# EAGLE design protoboard (EAGLE 5.11)
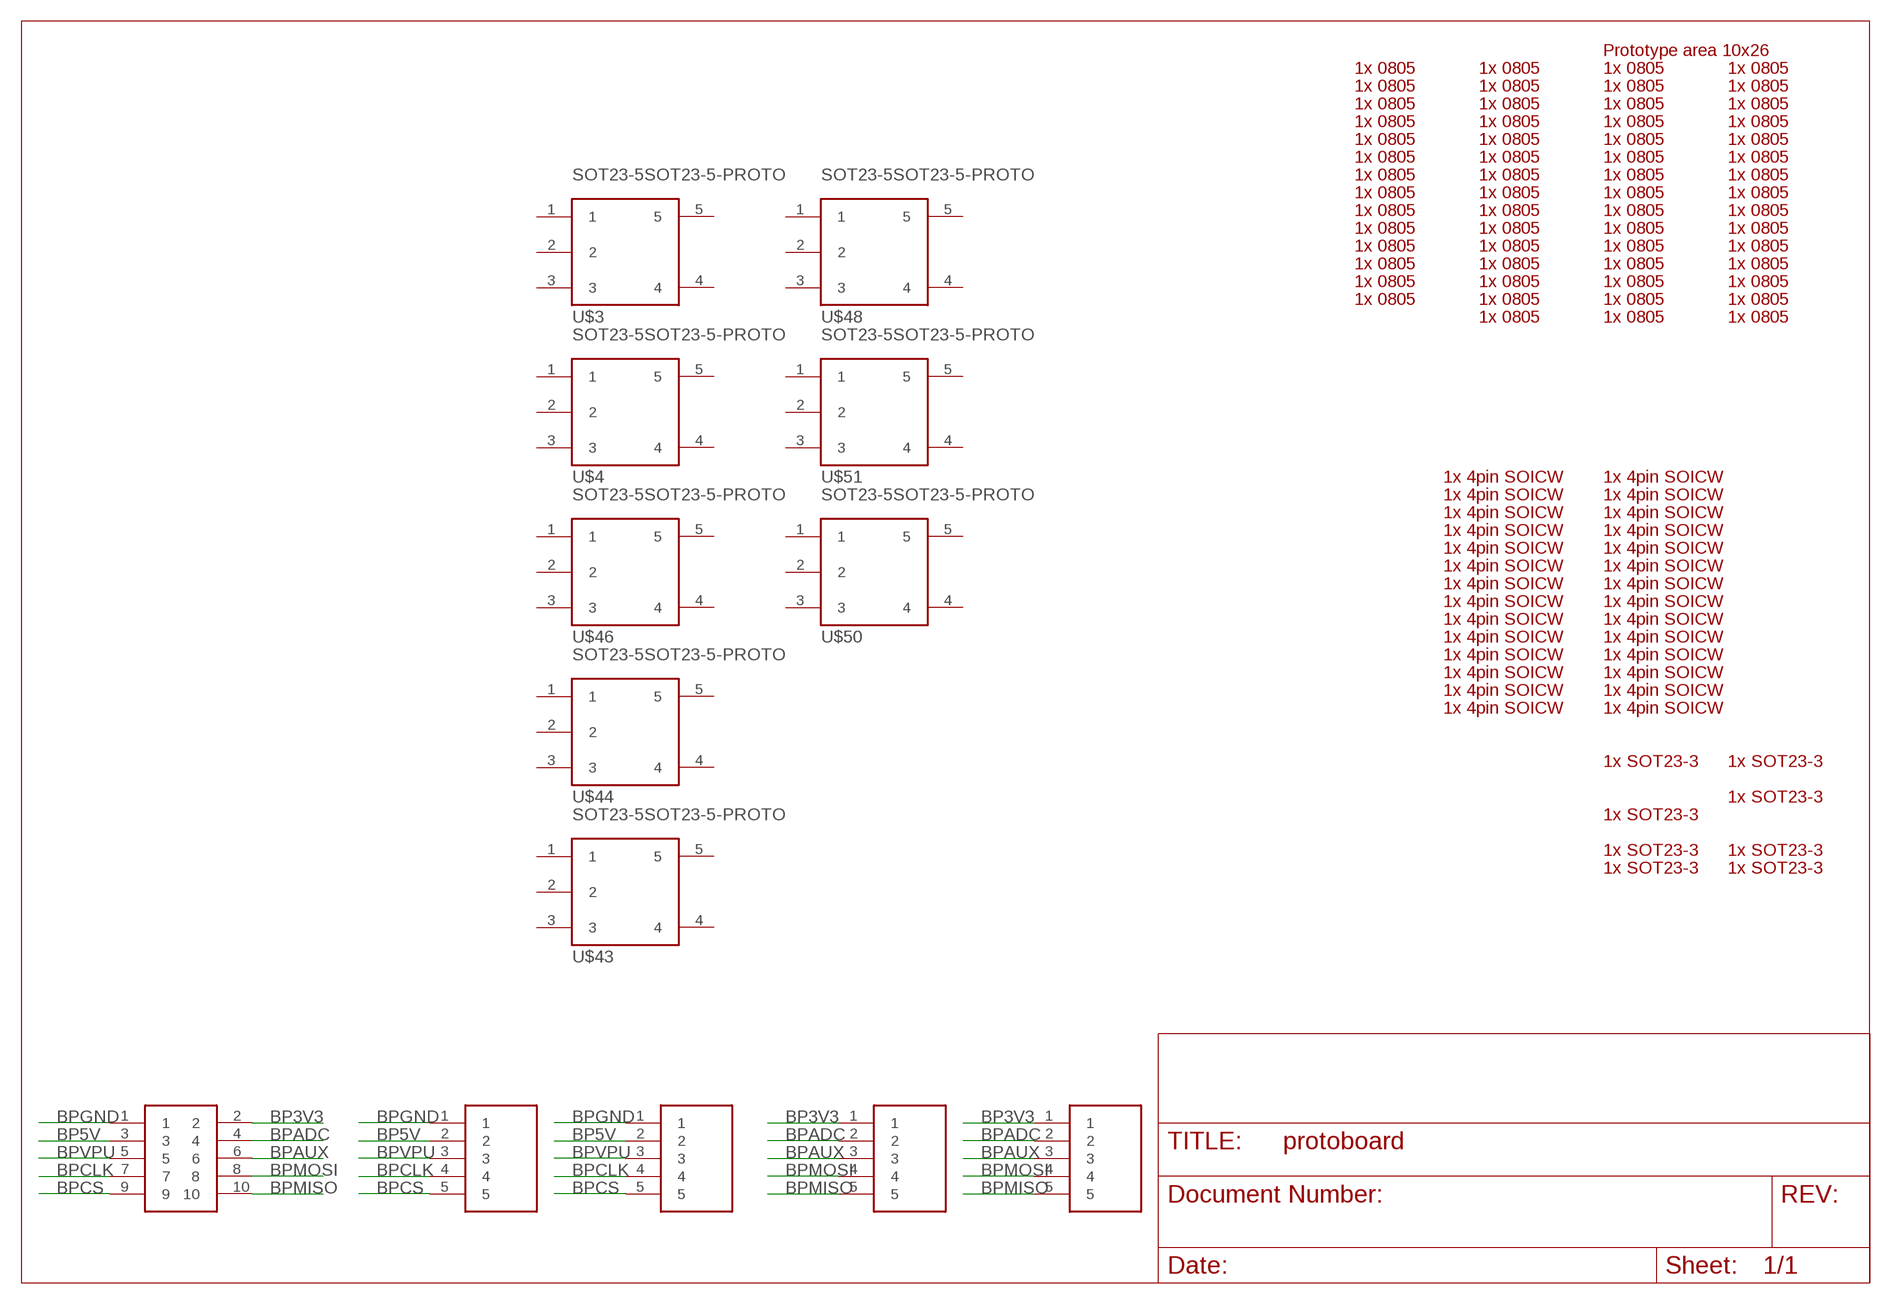
[diagram p0: schematic, sheet 1]

## Parts
J2  HEADER2X5PTH  [M2X5]
J3  HEADER1X5PTH  [M1X5]
J4  HEADER1X5PTH  [M1X5]
J5  HEADER1X5PTH  [M1X5]
J6  HEADER1X5PTH  [M1X5]
U$2  BB_SOT23-3  [BB_SOT23-3]
U$3  SOT23-5SOT23-5-PROTO  [SOT23-5-PROTO]
U$4  SOT23-5SOT23-5-PROTO  [SOT23-5-PROTO]
U$5  BB_SOT23-3  [BB_SOT23-3]
U$6  BB_SOICW  [BB_SOIC]
U$7  PROTO_10_26  [PROTO_10_26]
U$8  BB_RC0805  [BB_RC0805]
U$9  BB_RC0805  [BB_RC0805]
U$10  BB_RC0805  [BB_RC0805]
U$11  BB_RC0805  [BB_RC0805]
U$12  BB_RC0805  [BB_RC0805]
U$13  BB_RC0805  [BB_RC0805]
U$14  BB_RC0805  [BB_RC0805]
U$15  BB_RC0805  [BB_RC0805]
U$16  BB_RC0805  [BB_RC0805]
U$17  BB_RC0805  [BB_RC0805]
U$18  BB_RC0805  [BB_RC0805]
U$19  BB_RC0805  [BB_RC0805]
U$20  BB_RC0805  [BB_RC0805]
U$21  BB_RC0805  [BB_RC0805]
U$22  BB_RC0805  [BB_RC0805]
U$23  BB_RC0805  [BB_RC0805]
U$24  BB_RC0805  [BB_RC0805]
U$25  BB_RC0805  [BB_RC0805]
U$26  BB_RC0805  [BB_RC0805]
U$27  BB_RC0805  [BB_RC0805]
U$28  BB_RC0805  [BB_RC0805]
U$29  BB_RC0805  [BB_RC0805]
U$30  BB_RC0805  [BB_RC0805]
U$31  BB_RC0805  [BB_RC0805]
U$32  BB_RC0805  [BB_RC0805]
U$33  BB_RC0805  [BB_RC0805]
U$34  BB_SOICW  [BB_SOIC]
U$35  BB_SOICW  [BB_SOIC]
U$36  BB_SOICW  [BB_SOIC]
U$37  BB_SOICW  [BB_SOIC]
U$38  BB_SOICW  [BB_SOIC]
U$39  BB_SOICW  [BB_SOIC]
U$40  BB_SOICW  [BB_SOIC]
U$41  BB_SOICW  [BB_SOIC]
U$42  BB_SOT23-3  [BB_SOT23-3]
U$43  SOT23-5SOT23-5-PROTO  [SOT23-5-PROTO]
U$44  SOT23-5SOT23-5-PROTO  [SOT23-5-PROTO]
U$45  BB_SOT23-3  [BB_SOT23-3]
U$46  SOT23-5SOT23-5-PROTO  [SOT23-5-PROTO]
U$47  BB_SOT23-3  [BB_SOT23-3]
U$48  SOT23-5SOT23-5-PROTO  [SOT23-5-PROTO]
U$49  BB_SOT23-3  [BB_SOT23-3]
U$50  SOT23-5SOT23-5-PROTO  [SOT23-5-PROTO]
U$51  SOT23-5SOT23-5-PROTO  [SOT23-5-PROTO]
U$52  BB_RC0805  [BB_RC0805]
U$53  BB_RC0805  [BB_RC0805]
U$54  BB_RC0805  [BB_RC0805]
U$55  BB_RC0805  [BB_RC0805]
U$56  BB_RC0805  [BB_RC0805]
U$57  BB_RC0805  [BB_RC0805]
U$58  BB_SOICW  [BB_SOIC]
U$59  BB_SOICW  [BB_SOIC]
U$60  BB_SOICW  [BB_SOIC]
U$61  BB_SOICW  [BB_SOIC]
U$62  BB_SOICW  [BB_SOIC]
U$63  BB_SOICW  [BB_SOIC]
U$64  BB_SOICW  [BB_SOIC]
U$65  BB_SOICW  [BB_SOIC]
U$66  BB_SOT23-3  [BB_SOT23-3]
U$67  BB_SOT23-3  [BB_SOT23-3]
U$68  BB_RC0805  [BB_RC0805]
U$69  BB_RC0805  [BB_RC0805]
U$70  BB_RC0805  [BB_RC0805]
U$71  BB_RC0805  [BB_RC0805]
U$72  BB_RC0805  [BB_RC0805]
U$73  BB_RC0805  [BB_RC0805]
U$74  BB_RC0805  [BB_RC0805]
U$75  BB_RC0805  [BB_RC0805]
U$76  BB_RC0805  [BB_RC0805]
U$77  BB_RC0805  [BB_RC0805]
U$78  BB_RC0805  [BB_RC0805]
U$79  BB_RC0805  [BB_RC0805]
U$80  BB_RC0805  [BB_RC0805]
U$81  BB_RC0805  [BB_RC0805]
U$82  BB_RC0805  [BB_RC0805]
U$83  BB_RC0805  [BB_RC0805]
U$84  BB_RC0805  [BB_RC0805]
U$85  BB_RC0805  [BB_RC0805]
U$86  BB_RC0805  [BB_RC0805]
U$87  BB_RC0805  [BB_RC0805]
U$88  BB_RC0805  [BB_RC0805]
U$89  BB_RC0805  [BB_RC0805]
U$90  BB_RC0805  [BB_RC0805]
U$91  BB_SOICW  [BB_SOIC]
U$92  BB_RC0805  [BB_RC0805]
U$93  BB_RC0805  [BB_RC0805]
U$94  BB_SOICW  [BB_SOIC]
U$95  BB_RC0805  [BB_RC0805]
U$96  BB_RC0805  [BB_RC0805]
U$97  BB_SOICW  [BB_SOIC]
U$98  BB_SOICW  [BB_SOIC]
U$99  BB_SOICW  [BB_SOIC]
U$100  BB_SOICW  [BB_SOIC]
U$101  BB_SOICW  [BB_SOIC]
U$102  BB_SOICW  [BB_SOIC]
U$103  BB_SOICW  [BB_SOIC]
U$104  BB_SOICW  [BB_SOIC]
U$105  BB_SOICW  [BB_SOIC]

## Nets
BP3V3: J2.2 J5.1 J6.1
BP5V: J2.3 J3.2 J4.2
BPADC: J2.4 J5.2 J6.2
BPAUX: J2.6 J5.3 J6.3
BPCLK: J2.7 J3.4 J4.4
BPCS: J2.9 J3.5 J4.5
BPGND: J2.1 J3.1 J4.1
BPMISO: J2.10 J5.5 J6.5
BPMOSI: J2.8 J5.4 J6.4
BPVPU: J2.5 J3.3 J4.3
Unconnected: U$3.1 U$3.2 U$3.3 U$3.4 U$3.5 U$4.1 U$4.2 U$4.3 U$4.4 U$4.5 U$43.1 U$43.2 U$43.3 U$43.4 U$43.5 U$44.1 U$44.2 U$44.3 U$44.4 U$44.5 U$46.1 U$46.2 U$46.3 U$46.4 U$46.5 U$48.1 U$48.2 U$48.3 U$48.4 U$48.5 U$50.1 U$50.2 U$50.3 U$50.4 U$50.5 U$51.1 U$51.2 U$51.3 U$51.4 U$51.5

## Library data of the parts
J2 = dp_devices:HEADER2X5
J3-J6 = dp_devices:HEADER1X5
U$2 U$5 U$42 U$45 U$47 U$49 U$66 U$67 = dp_devices:BB_SOT23-3
U$3 U$4 U$43 U$44 U$46 U$48 U$50 U$51 = ajray:SOT23-5
U$6 U$34-U$41 U$58-U$65 U$91 U$94 U$97-U$105 = dp_devices:BB_SOICW
U$7 = dp_devices:PROTO_10_26
U$8-U$33 U$52-U$57 U$68-U$90 U$92 U$93 U$95 U$96 = dp_devices:BB_RC0805

## Board
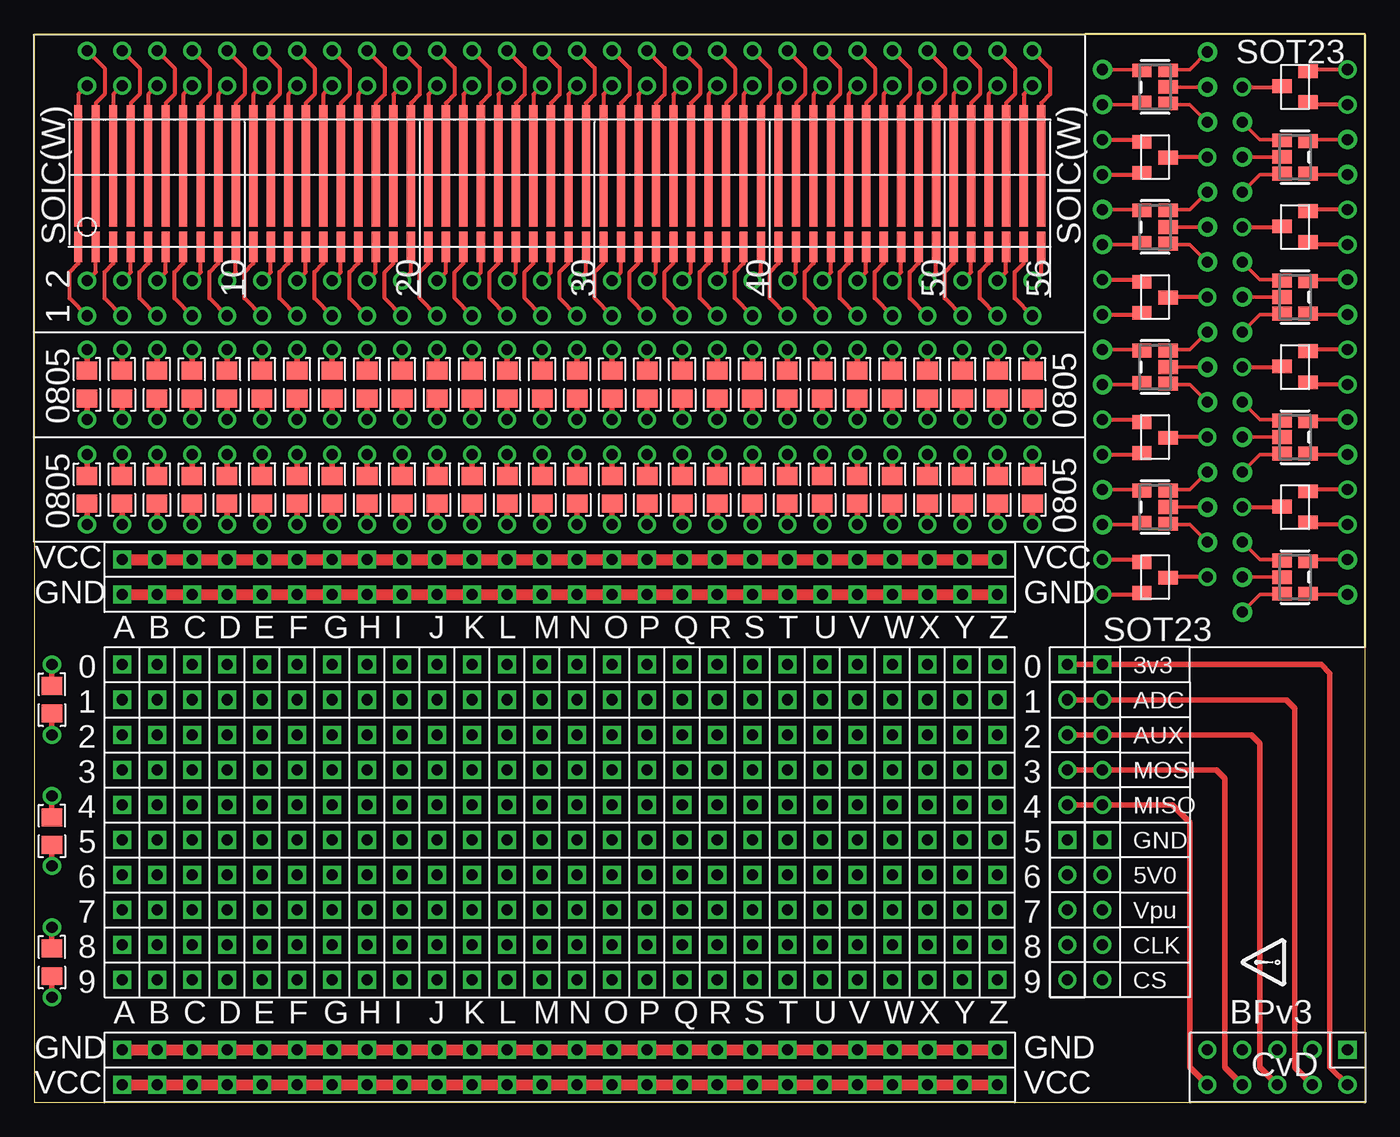
[diagram p1: board, top side]
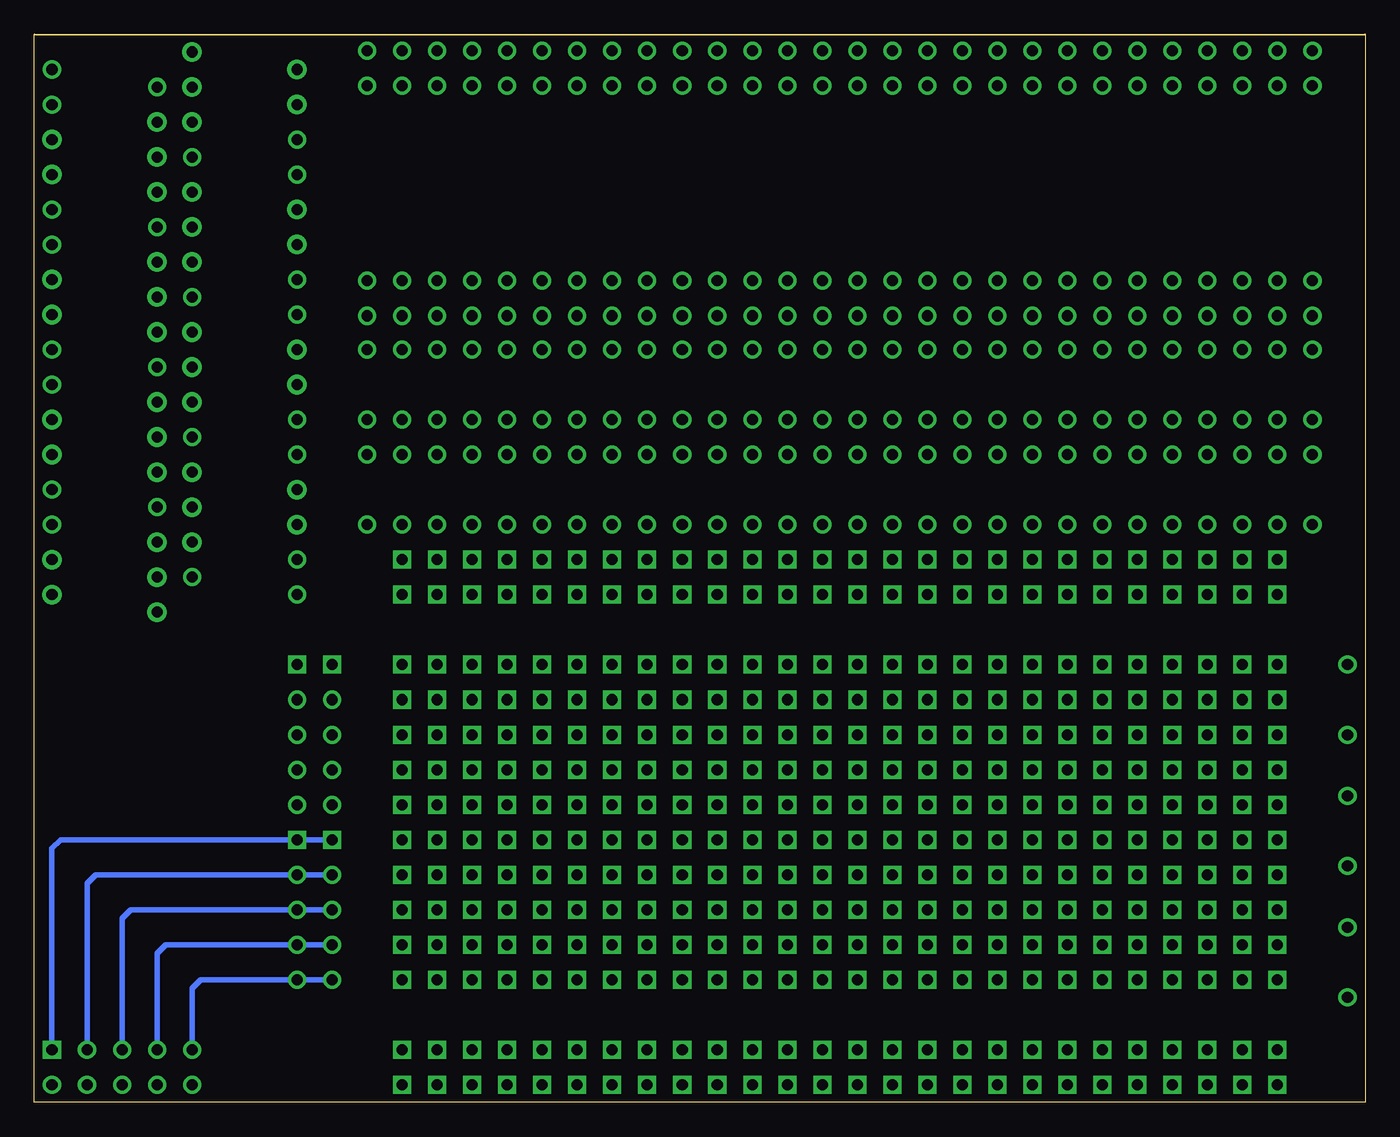
[diagram p2: board, bottom side, seen from below]

Size 96.52 x 77.47 mm. Coordinates in mm from the lower left corner, seen from the top.
Outline: 0,0 96.52,0 96.52,77.47 0,77.46 0,0
Copper layers (1*16): Top 0.035mm / dielectric 1.5mm / Bottom 0.035mm
Design rules "Fusion_eagle_rule_v1.1": minimum track width 6mil, minimum drill 12mil, track to track 6mil, track to pad 6mil, pad to pad 6mil, via to via 6mil, smd to smd 0mil, copper to edge 10mil, drill to drill 10mil, minimum pad ring 10mil, minimum via ring 6mil, stop-mask expansion 2mil, vias tented up to drill 100mil, thermal gap 10mil

### Footprints (pad centres in the part's own frame; a part is rotated, then mirrored left to right if it is on the bottom)
M2X5 = drill 0.8 square: 1 -5.08,-1.27 | drill 0.8 round: 2 -5.08,1.27; 3 -2.54,-1.27; 4 -2.54,1.27; 5 0,-1.27; 6 0,1.27; 7 2.54,-1.27; 8 2.54,1.27; 9 5.08,-1.27; 10 5.08,1.27
M1X5 = drill 0.8 square: 1 -5.08,0 | drill 0.8 round: 2 -2.54,0; 3 0,0; 4 2.54,0; 5 5.08,0
BB_SOT23-3 = smd 1.4 x 1: P$1 -0.95,1.1; P$2 -0.95,-1.15; P$3 0.95,-0.05 | drill 0.8 round: P$4 -3.81,-1.27; P$5 -3.81,1.27; P$6 3.81,0
SOT23-5-PROTO = smd 1.4 x 1: 1 -0.95,1.2; 2 -0.95,0; 3 -0.95,-1.2; 4 0.95,-1.2; 5 0.95,1.15 | drill 0.8 pad 1.422 round: P$1 -3.81,0; P$2 -3.81,-2.54; P$3 -3.81,2.54; P$4 3.81,-1.27; P$5 3.81,1.27
BB_SOIC = smd 2.2 x 0.6: P$1 -4.61,0.635; P$2 -4.61,-0.635 | smd 8.8 x 0.6: P$3 1.27,-0.635; P$4 1.27,0.635 | drill 0.8 round: P$5 -7.08,0; P$6 -9.62,0; P$7 7.08,0; P$8 9.62,0
PROTO_10_26 = drill 0.8 square: 1 -31.75,-11.43; 2 -29.21,-11.43; 3 -26.67,-11.43; 4 -24.13,-11.43; 5 -21.59,-11.43; 6 -19.05,-11.43; 7 -16.51,-11.43; 8 -13.97,-11.43; 9 -11.43,-11.43; 10 -8.89,-11.43; 11 -6.35,-11.43; 12 -3.81,-11.43; 13 -1.27,-11.43; 14 1.27,-11.43; 15 3.81,-11.43; 16 6.35,-11.43; 17 8.89,-11.43; 18 11.43,-11.43; 19 13.97,-11.43; 20 16.51,-11.43; 21 19.05,-11.43; 22 21.59,-11.43; 23 24.13,-11.43; 24 26.67,-11.43; 25 29.21,-11.43; 26 31.75,-11.43; 27 -31.75,-8.89; 28 -29.21,-8.89; 29 -26.67,-8.89; 30 -24.13,-8.89; 31 -21.59,-8.89; 32 -19.05,-8.89; 33 -16.51,-8.89; 34 -13.97,-8.89; 35 -11.43,-8.89; 36 -8.89,-8.89; 37 -6.35,-8.89; 38 -3.81,-8.89; 39 -1.27,-8.89; 40 1.27,-8.89; 41 3.81,-8.89; 42 6.35,-8.89; 43 8.89,-8.89; 44 11.43,-8.89; 45 13.97,-8.89; 46 16.51,-8.89; 47 19.05,-8.89; 48 21.59,-8.89; 49 24.13,-8.89; 50 26.67,-8.89; 51 29.21,-8.89; 52 31.75,-8.89; 53 -31.75,-6.35; 54 -29.21,-6.35; 55 -26.67,-6.35; 56 -24.13,-6.35; 57 -21.59,-6.35; 58 -19.05,-6.35; 59 -16.51,-6.35; 60 -13.97,-6.35; 61 -11.43,-6.35; 62 -8.89,-6.35; 63 -6.35,-6.35; 64 -3.81,-6.35; 65 -1.27,-6.35; 66 1.27,-6.35; 67 3.81,-6.35; 68 6.35,-6.35; 69 8.89,-6.35; 70 11.43,-6.35; 71 13.97,-6.35; 72 16.51,-6.35; 73 19.05,-6.35; 74 21.59,-6.35; 75 24.13,-6.35; 76 26.67,-6.35; 77 29.21,-6.35; 78 31.75,-6.35; 79 -31.75,-3.81; 80 -29.21,-3.81; 81 -26.67,-3.81; 82 -24.13,-3.81; 83 -21.59,-3.81; 84 -19.05,-3.81; 85 -16.51,-3.81; 86 -13.97,-3.81; 87 -11.43,-3.81; 88 -8.89,-3.81; 89 -6.35,-3.81; 90 -3.81,-3.81; 91 -1.27,-3.81; 92 1.27,-3.81; 93 3.81,-3.81; 94 6.35,-3.81; 95 8.89,-3.81; 96 11.43,-3.81; 97 13.97,-3.81; 98 16.51,-3.81; 99 19.05,-3.81; 100 21.59,-3.81; 101 24.13,-3.81; 102 26.67,-3.81; 103 29.21,-3.81; 104 31.75,-3.81; 105 -31.75,-1.27; 106 -29.21,-1.27; 107 -26.67,-1.27; 108 -24.13,-1.27; 109 -21.59,-1.27; 110 -19.05,-1.27; 111 -16.51,-1.27; 112 -13.97,-1.27; 113 -11.43,-1.27; 114 -8.89,-1.27; 115 -6.35,-1.27; 116 -3.81,-1.27; 117 -1.27,-1.27; 118 1.27,-1.27; 119 3.81,-1.27; 120 6.35,-1.27; 121 8.89,-1.27; 122 11.43,-1.27; 123 13.97,-1.27; 124 16.51,-1.27; 125 19.05,-1.27; 126 21.59,-1.27; 127 24.13,-1.27; 128 26.67,-1.27; 129 29.21,-1.27; 130 31.75,-1.27; 131 -31.75,1.27; 132 -29.21,1.27; 133 -26.67,1.27; 134 -24.13,1.27; 135 -21.59,1.27; 136 -19.05,1.27; 137 -16.51,1.27; 138 -13.97,1.27; 139 -11.43,1.27; 140 -8.89,1.27; 141 -6.35,1.27; 142 -3.81,1.27; 143 -1.27,1.27; 144 1.27,1.27; 145 3.81,1.27; 146 6.35,1.27; 147 8.89,1.27; 148 11.43,1.27; 149 13.97,1.27; 150 16.51,1.27; 151 19.05,1.27; 152 21.59,1.27; 153 24.13,1.27; 154 26.67,1.27; 155 29.21,1.27; 156 31.75,1.27; 157 -31.75,3.81; 158 -29.21,3.81; 159 -26.67,3.81; 160 -24.13,3.81; 161 -21.59,3.81; 162 -19.05,3.81; 163 -16.51,3.81; 164 -13.97,3.81; 165 -11.43,3.81; 166 -8.89,3.81; 167 -6.35,3.81; 168 -3.81,3.81; 169 -1.27,3.81; 170 1.27,3.81; 171 3.81,3.81; 172 6.35,3.81; 173 8.89,3.81; 174 11.43,3.81; 175 13.97,3.81; 176 16.51,3.81; 177 19.05,3.81; 178 21.59,3.81; 179 24.13,3.81; 180 26.67,3.81; 181 29.21,3.81; 182 31.75,3.81; 183 -31.75,6.35; 184 -29.21,6.35; 185 -26.67,6.35; 186 -24.13,6.35; 187 -21.59,6.35; 188 -19.05,6.35; 189 -16.51,6.35; 190 -13.97,6.35; 191 -11.43,6.35; 192 -8.89,6.35; 193 -6.35,6.35; 194 -3.81,6.35; 195 -1.27,6.35; 196 1.27,6.35; 197 3.81,6.35; 198 6.35,6.35; 199 8.89,6.35; 200 11.43,6.35; 201 13.97,6.35; 202 16.51,6.35; 203 19.05,6.35; 204 21.59,6.35; 205 24.13,6.35; 206 26.67,6.35; 207 29.21,6.35; 208 31.75,6.35; 209 -31.75,8.89; 210 -29.21,8.89; 211 -26.67,8.89; 212 -24.13,8.89; 213 -21.59,8.89; 214 -19.05,8.89; 215 -16.51,8.89; 216 -13.97,8.89; 217 -11.43,8.89; 218 -8.89,8.89; 219 -6.35,8.89; 220 -3.81,8.89; 221 -1.27,8.89; 222 1.27,8.89; 223 3.81,8.89; 224 6.35,8.89; 225 8.89,8.89; 226 11.43,8.89; 227 13.97,8.89; 228 16.51,8.89; 229 19.05,8.89; 230 21.59,8.89; 231 24.13,8.89; 232 26.67,8.89; 233 29.21,8.89; 234 31.75,8.89; 235 -31.75,11.43; 236 -29.21,11.43; 237 -26.67,11.43; 238 -24.13,11.43; 239 -21.59,11.43; 240 -19.05,11.43; 241 -16.51,11.43; 242 -13.97,11.43; 243 -11.43,11.43; 244 -8.89,11.43; 245 -6.35,11.43; 246 -3.81,11.43; 247 -1.27,11.43; 248 1.27,11.43; 249 3.81,11.43; 250 6.35,11.43; 251 8.89,11.43; 252 11.43,11.43; 253 13.97,11.43; 254 16.51,11.43; 255 19.05,11.43; 256 21.59,11.43; 257 24.13,11.43; 258 26.67,11.43; 259 29.21,11.43; 260 31.75,11.43; G30 -31.75,16.51; G31 -29.21,16.51; G32 -26.67,16.51; G33 -24.13,16.51; G34 -21.59,16.51; G35 -19.05,16.51; G36 -16.51,16.51; G37 -13.97,16.51; G38 -11.43,16.51; G39 -8.89,16.51; G40 -31.75,-16.51; G41 -29.21,-16.51; G42 -26.67,-16.51; G43 -24.13,-16.51; G44 -21.59,-16.51; G45 -19.05,-16.51; G46 -16.51,-16.51; G47 -13.97,-16.51; G48 -11.43,-16.51; G49 -8.89,-16.51; G310 -6.35,16.51; G311 -3.81,16.51; G312 -1.27,16.51; G313 1.27,16.51; G314 3.81,16.51; G315 6.35,16.51; G316 8.89,16.51; G317 11.43,16.51; G318 13.97,16.51; G319 16.51,16.51; G320 19.05,16.51; G321 21.59,16.51; G322 24.13,16.51; G323 26.67,16.51; G324 29.21,16.51; G325 31.75,16.51; G410 -6.35,-16.51; G411 -3.81,-16.51; G412 -1.27,-16.51; G413 1.27,-16.51; G414 3.81,-16.51; G415 6.35,-16.51; G416 8.89,-16.51; G417 11.43,-16.51; G418 13.97,-16.51; G419 16.51,-16.51; G420 19.05,-16.51; G421 21.59,-16.51; G422 24.13,-16.51; G423 26.67,-16.51; G424 29.21,-16.51; G425 31.75,-16.51; V30 -31.75,19.05; V31 -29.21,19.05; V32 -26.67,19.05; V33 -24.13,19.05; V34 -21.59,19.05; V35 -19.05,19.05; V36 -16.51,19.05; V37 -13.97,19.05; V38 -11.43,19.05; V39 -8.89,19.05; V40 -31.75,-19.05; V41 -29.21,-19.05; V42 -26.67,-19.05; V43 -24.13,-19.05; V44 -21.59,-19.05; V45 -19.05,-19.05; V46 -16.51,-19.05; V47 -13.97,-19.05; V48 -11.43,-19.05; V49 -8.89,-19.05; V310 -6.35,19.05; V311 -3.81,19.05; V312 -1.27,19.05; V313 1.27,19.05; V314 3.81,19.05; V315 6.35,19.05; V316 8.89,19.05; V317 11.43,19.05; V318 13.97,19.05; V319 16.51,19.05; V320 19.05,19.05; V321 21.59,19.05; V322 24.13,19.05; V323 26.67,19.05; V324 29.21,19.05; V325 31.75,19.05; V410 -6.35,-19.05; V411 -3.81,-19.05; V412 -1.27,-19.05; V413 1.27,-19.05; V414 3.81,-19.05; V415 6.35,-19.05; V416 8.89,-19.05; V417 11.43,-19.05; V418 13.97,-19.05; V419 16.51,-19.05; V420 19.05,-19.05; V421 21.59,-19.05; V422 24.13,-19.05; V423 26.67,-19.05; V424 29.21,-19.05; V425 31.75,-19.05
BB_RC0805 = smd 1.3 x 1.5: P$1 -1,0; P$2 1,0 | drill 0.8 round: P$3 -2.54,0; P$4 2.54,0

### Placement (x,y rotation side)
J2  90.17,2.54 180 top
J3  77.47,13.97 270 top
J4  74.93,13.97 270 top
J5  77.47,26.67 270 top
J6  74.93,26.67 270 top
U$2  81.28,68.58 0 top
U$3  81.28,73.66 180 top
U$4  91.44,68.58 0 top
U$5  91.44,73.66 180 top
U$6  44.45,66.67 90 top
U$7  38.1,20.32 0 top
U$8  6.35,44.45 90 top
U$9  8.89,44.45 90 top
U$10  11.43,44.45 90 top
U$11  13.97,44.45 90 top
U$12  16.51,44.45 90 top
U$13  19.05,44.45 90 top
U$14  21.59,44.45 90 top
U$15  24.13,44.45 90 top
U$16  26.67,44.45 90 top
U$17  29.21,44.45 90 top
U$18  31.75,44.45 90 top
U$19  34.29,44.45 90 top
U$20  36.83,44.45 90 top
U$21  41.91,44.45 90 top
U$22  39.37,44.45 90 top
U$23  44.45,44.45 90 top
U$24  46.99,44.45 90 top
U$25  49.53,44.45 90 top
U$26  52.07,44.45 90 top
U$27  54.61,44.45 90 top
U$28  57.15,44.45 90 top
U$29  59.69,44.45 90 top
U$30  62.23,44.45 90 top
U$31  64.77,44.45 90 top
U$32  67.31,44.45 90 top
U$33  69.85,44.45 90 top
U$34  3.81,66.67 90 top
U$35  6.35,66.67 90 top
U$36  8.89,66.67 90 top
U$37  11.43,66.67 90 top
U$38  13.97,66.67 90 top
U$39  16.51,66.67 90 top
U$40  19.05,66.67 90 top
U$41  21.59,66.67 90 top
U$42  91.44,63.5 180 top
U$43  81.28,53.34 180 top
U$44  81.28,63.5 180 top
U$45  91.44,43.18 180 top
U$46  91.44,58.42 0 top
U$47  91.44,53.34 180 top
U$48  91.44,48.26 0 top
U$49  81.28,48.26 0 top
U$50  81.28,43.18 180 top
U$51  91.44,38.1 0 top
U$52  3.81,44.45 90 top
U$53  72.39,44.45 90 top
U$54  1.27,19.68 90 top
U$55  1.27,10.16 90 top
U$56  1.27,29.21 90 top
U$57  6.35,52.07 90 top
U$58  24.13,66.67 90 top
U$59  26.67,66.67 90 top
U$60  29.21,66.67 90 top
U$61  31.75,66.67 90 top
U$62  34.29,66.67 90 top
U$63  36.83,66.67 90 top
U$64  39.37,66.67 90 top
U$65  41.91,66.67 90 top
U$66  81.28,38.1 0 top
U$67  81.28,58.42 0 top
U$68  19.05,52.07 90 top
U$69  13.97,52.07 90 top
U$70  3.81,52.07 90 top
U$71  11.43,52.07 90 top
U$72  21.59,52.07 90 top
U$73  8.89,52.07 90 top
U$74  16.51,52.07 90 top
U$75  24.13,52.07 90 top
U$76  36.83,52.07 90 top
U$77  26.67,52.07 90 top
U$78  31.75,52.07 90 top
U$79  39.37,52.07 90 top
U$80  29.21,52.07 90 top
U$81  34.29,52.07 90 top
U$82  64.77,52.07 90 top
U$83  54.61,52.07 90 top
U$84  41.91,52.07 90 top
U$85  69.85,52.07 90 top
U$86  59.69,52.07 90 top
U$87  44.45,52.07 90 top
U$88  72.39,52.07 90 top
U$89  57.15,52.07 90 top
U$90  49.53,52.07 90 top
U$91  46.99,66.67 90 top
U$92  67.31,52.07 90 top
U$93  52.07,52.07 90 top
U$94  49.53,66.67 90 top
U$95  62.23,52.07 90 top
U$96  46.99,52.07 90 top
U$97  52.07,66.67 90 top
U$98  54.61,66.67 90 top
U$99  57.15,66.67 90 top
U$100  59.69,66.67 90 top
U$101  62.23,66.67 90 top
U$102  64.77,66.67 90 top
U$103  67.31,66.67 90 top
U$104  69.85,66.67 90 top
U$105  72.39,66.67 90 top
U$106  [DP_LOGO]  90.17,10.16 90 top

### Tracks (layer width: path | path; a pad name or v marks a point on that pad's centre or on a via)
BP3V3
  Top 0.406: J2.2 93.98,2.54 93.98,31.11 93.34,31.75 J5.1 | J5.1 J6.1 J5.1
BP5V
  Bottom 0.406: J2.3 92.71,15.88 92.08,16.51 J3.2 | J3.2 J4.2 J3.2
BPADC
  Top 0.406: J2.4 91.44,2.54 91.44,28.57 90.81,29.21 J5.2 | J5.2 J6.2 J5.2
BPAUX
  Top 0.406: J2.6 88.9,2.54 88.9,26.04 88.27,26.67 J5.3 | J5.3 J6.3 J5.3
BPCLK
  Bottom 0.406: J2.7 87.63,10.79 87,11.43 J3.4 | J3.4 J4.4 J3.4
BPCS
  Bottom 0.406: J2.9 85.09,8.26 84.45,8.89 J3.5 | J3.5 J4.5 J3.5
BPGND
  Bottom 0.406: J3.1 J4.1 J3.1 | J3.1 94.61,19.05 95.25,18.41 J2.1
BPMISO
  Top 0.406: J2.10 83.82,2.54 83.82,20.32 82.55,21.59 J5.5 | J5.5 J6.5 J5.5
BPMOSI
  Top 0.406: J2.8 86.36,2.54 86.36,23.5 85.72,24.13 J5.4 | J5.4 J6.4 J5.4
BPVPU
  Bottom 0.406: J2.5 90.17,13.34 89.53,13.97 J3.3 | J3.3 J4.3 J3.3

### Text on the board
tPlace: SOT23 | SOIC(W) | SOIC(W) | 2 | 10 | 20 | 30 | 40 | 50 | 56 | 1 | 0805 | 0805 | 0805 | 0805 | SOT23 | 3v3 | ADC | AUX | MOSI | MISO | GND | 5V0 | Vpu | CLK | CS | BPv3 | CvD